# Altium schematic sheet Sheet1.SchDoc
size B
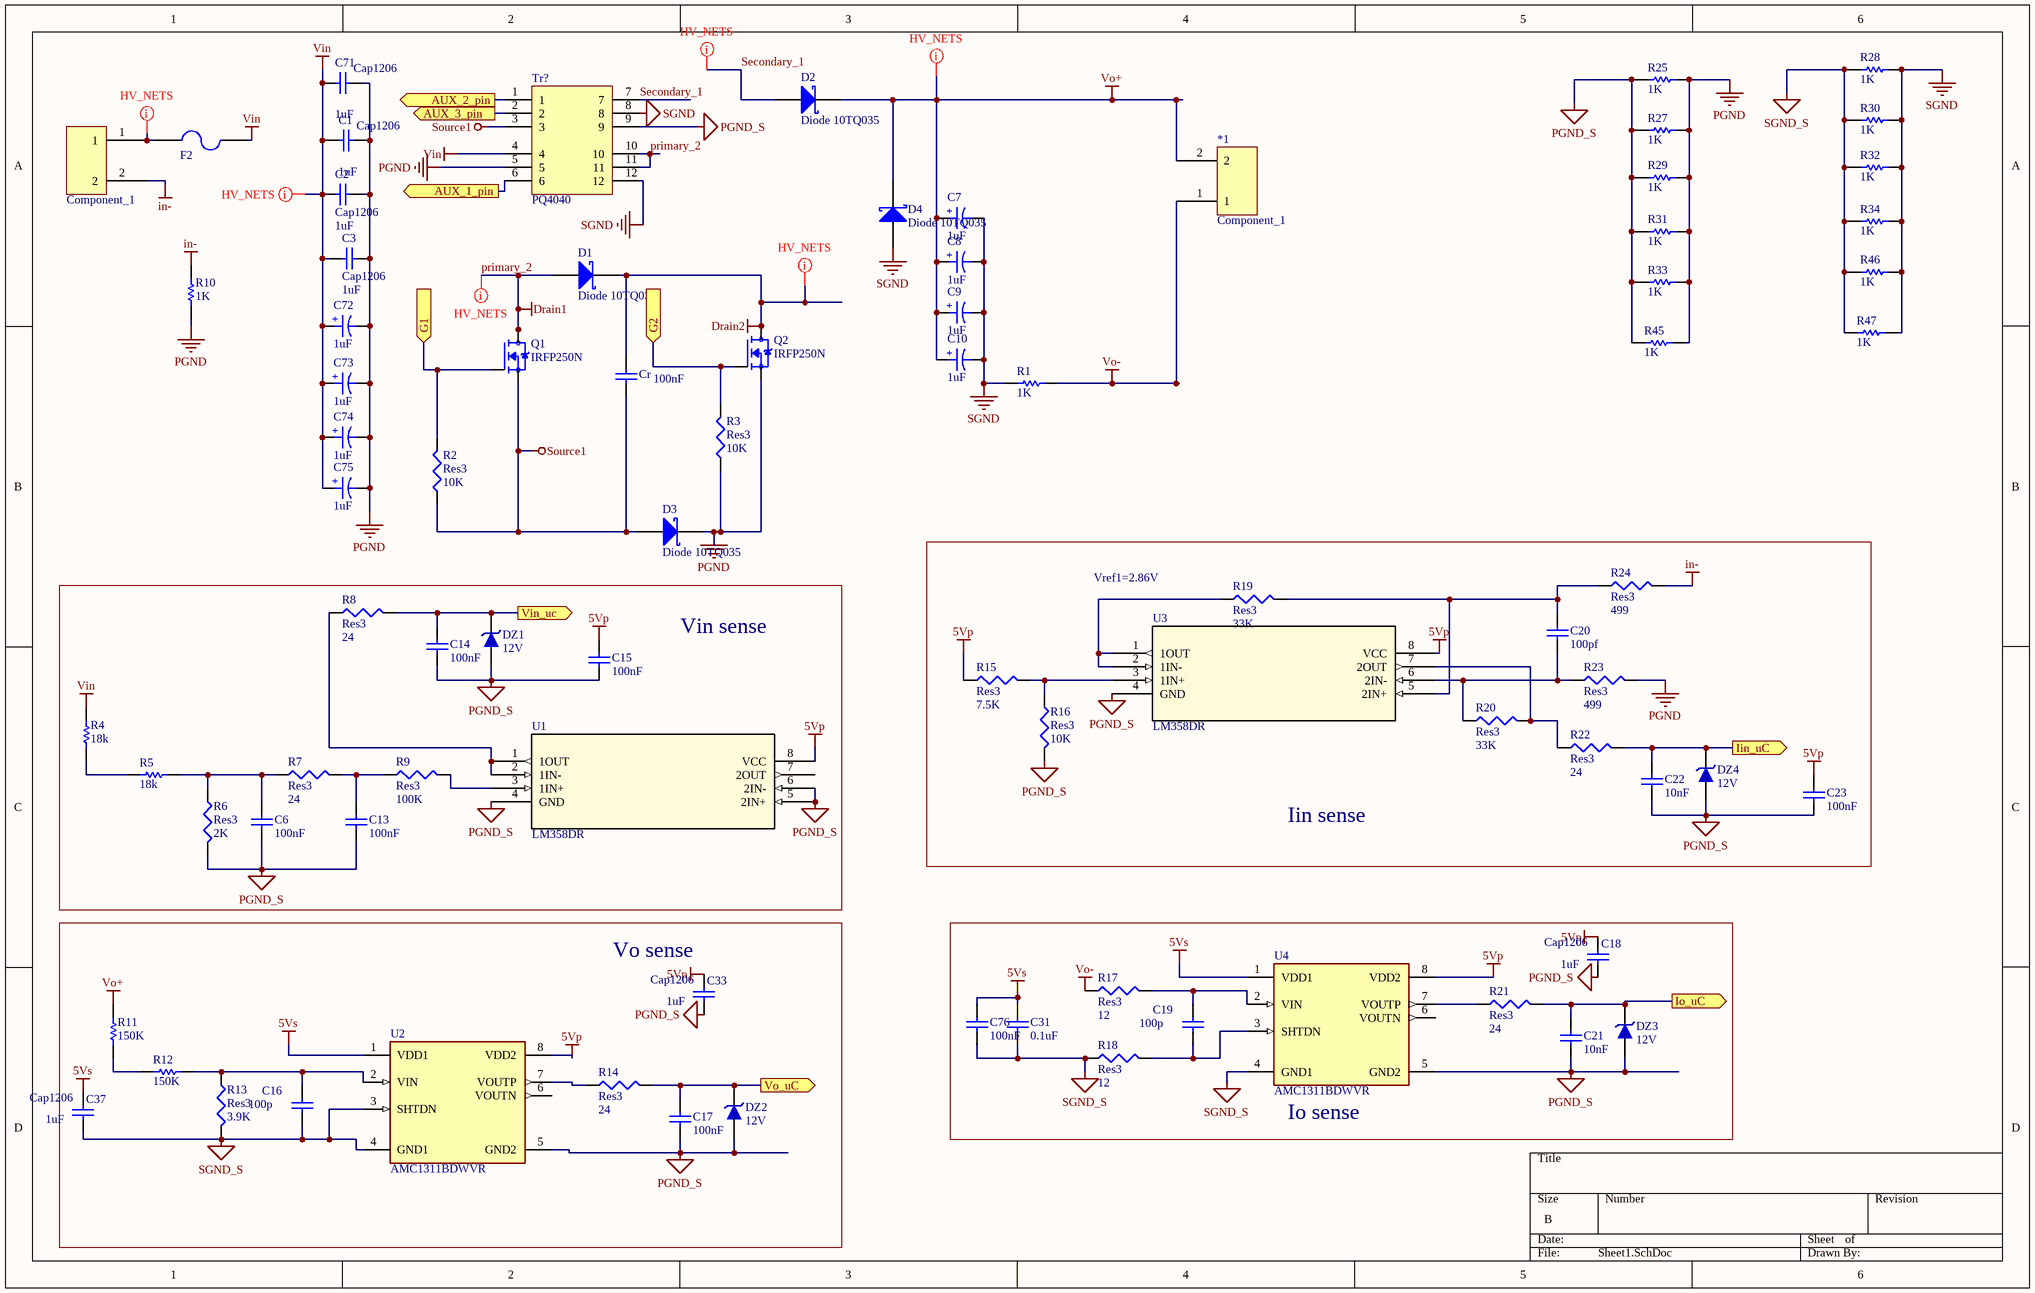
[diagram p0: Sheet1.SchDoc]

## Parts
*1  Component_1  [PCBComponent_1]
?  Component_1  [PCBComponent_1]
C1  Cap1206  value 1uF  [C1206]
C2  Cap1206  value 1uF  [C1206]
C3  Cap1206  value 1uF  [C1206]
C6  100nF  [CAP0603]
C7  1uF  [Cap electrolitic radial 12.5x25-5]
C8  1uF  [Cap electrolitic radial 12.5x25-5]
C9  1uF  [Cap electrolitic radial 16x26-7.5]
C10  1uF  [Cap electrolitic radial 16x26-7.5]
C13  100nF  [CAP0603]
C14  100nF  [CAP0603]
C15  100nF  [CAP0603]
C16  100p  [CAP0603]
C17  100nF  [CAP0603]
C18  Cap1206  value 1uF  [C1206]
C19  100p  [CAP0603]
C20  100pf  [CAP0603]
C21  10nF  [CAP0603]
C22  10nF  [CAP0603]
C23  100nF  [CAP0603]
C31  0.1uF  [CAPC4817X12N]
C33  Cap1206  value 1uF  [C1206]
C37  Cap1206  value 1uF  [C1206]
C71  Cap1206  value 1uF  [C1206]
C72  1uF  [Cap electrolitic radial 10x16-5]
C73  1uF  [Cap electrolitic radial 10x16-5]
C74  1uF  [Cap electrolitic radial 10x16-5]
C75  1uF  [Cap electrolitic radial 12.5x25-5]
C76  100nF  [CAP0603]
Cr  100nF  [CAP-100nF-275V]
D1  Diode 10TQ035  [TO-220AC]
D2  Diode 10TQ035  [TO-220AC]
D3  Diode 10TQ035  [TO-220AC]
D4  Diode 10TQ035  [TO-220AC]
DZ1  12V  [SOD80, LL-34]
DZ2  12V  [SOD80, LL-34]
DZ3  12V  [SOD80, LL-34]
DZ4  12V  [SOD80, LL-34]
F2  F=1.0 A  [Fuse 5x20 With holder pin]  (value not drawn)
Q1  IRFP250N  [TO545P1590X530X2460-3]
Q2  IRFP250N  [TO545P1590X530X2460-3]
R1  1K  [RES2512]
R2  Res3  value 10K  [J1-0603]
R3  Res3  value 10K  [J1-0603]
R4  18k  [RESC4817X04N]
R5  18k  [RESC4817X04N]
R6  Res3  value 2K  [J1-0603]
R7  Res3  value 24  [J1-0603]
R8  Res3  value 24  [J1-0603]
R9  Res3  value 100K  [J1-0603]
R10  1K  [RES2512]
R11  150K  [RESC4817X04N]
R12  150K  [RESC4817X04N]
R13  Res3  value 3.9K  [J1-0603]
R14  Res3  value 24  [J1-0603]
R15  Res3  value 7.5K  [J1-0603]
R16  Res3  value 10K  [J1-0603]
R17  Res3  value 12  [J1-0603]
R18  Res3  value 12  [J1-0603]
R19  Res3  value 33K  [J1-0603]
R20  Res3  value 33K  [J1-0603]
R21  Res3  value 24  [J1-0603]
R22  Res3  value 24  [J1-0603]
R23  Res3  value 499  [J1-0603]
R24  Res3  value 499  [J1-0603]
R25  1K  [RESC3413X04N]
R27  1K  [RESC3413X04N]
R28  1K  [RESC3413X04N]
R29  1K  [RESC3413X04N]
R30  1K  [RESC3413X04N]
R31  1K  [RESC3413X04N]
R32  1K  [RESC3413X04N]
R33  1K  [RESC3413X04N]
R34  1K  [RESC3413X04N]
R45  1K  [RESC3413X04N]
R46  1K  [RESC3413X04N]
R47  1K  [RESC3413X04N]
Tr?  PQ4040  [PQ4040]
U1  LM358DR  [D8]
U2  AMC1311BDWVR  [SOIC127P1150X280-8N]
U3  LM358DR  [D8]
U4  AMC1311BDWVR  [SOIC127P1150X280-8N]

## Blocks framed on the sheet
Iin sense: C20 C22 C23 DZ4 R15 R16 R19 R20 R22-R24 U3
Vin sense: C6 C13-C15 DZ1 R4-R9 U1
Vo sense: C16 C17 C33 C37 DZ2 R11-R14 U2
Io sense: C18 C19 C21 C31 C76 DZ3 R17 R18 R21 U4

## Ports
AUX_1_pin (out), AUX_2_pin (out), AUX_3_pin (out), G1 (in), G2 (in), Iin_uC (out), Io_uC (out), Vin_uc (out), Vo_uC (out)

## Nets
5Vp: C15.2 C18.1 C23.2 C33.1 R15.1 U1.8(VCC) U2.8(VDD2) U3.8(VCC) U4.8(VDD2)
5Vs: C31.1 C37.1 C76.2 U2.1(VDD1) U4.1(VDD1)
Drain2: Cr.2 D1.1(K) Q2.2(D)
in-: ?.2 R10.1 R24.2
PGND: C1.2 C2.2 C3.2 C71.2 C72.2 C73.2 C74.2 C75.2 D3.1(K) Q2.3(S) R3.1 R10.2 R23.2 R25.2 R27.2 R29.2 R31.2 R33.2 R45.2 Tr?.5
PGND_S: C6.1 C13.1 C14.1 C15.1 C17.1 C18.2 C21.1 C22.1 C23.1 C33.2 DZ1.1 DZ2.1 DZ3.1 DZ4.1 R6.2 R16.2 R25.1 R27.1 R29.1 R31.1 R33.1 R45.1 Tr?.9 U1.4(GND) U1.5(2IN+) U1.6(2IN-) U2.5(GND2) U3.4(GND) U4.5(GND2)
primary_2: D1.3(A) Q1.2(D) Tr?.10 Tr?.11  [also labelled Drain1]
SGND: C7.2 C8.2 C9.2 C10.2 D4.3(A) R1.1 R28.2 R30.2 R32.2 R34.2 R46.2 R47.2 Tr?.8 Tr?.12
SGND_S: C16.1 C31.2 C37.2 C76.1 R13.2 R18.1 R28.1 R30.1 R32.1 R34.1 R46.1 R47.1 U2.3(SHTDN) U2.4(GND1) U4.4(GND1)
Source1: Cr.1 D3.3(A) Q1.3(S) R2.1 Tr?.3
Vin: C1.1 C2.1 C3.1 C71.1 C72.1 C73.1 C74.1 C75.1 F2.2 R4.2 Tr?.4
Vo+: *1.2 C7.1 C8.1 C9.1 C10.1 D2.1(K) D4.1(K) R11.2
Vo-: *1.1 R1.2 R17.1
AUX_1_pin: Tr?.6 ; port AUX_1_pin
AUX_2_pin: Tr?.1 ; port AUX_2_pin
AUX_3_pin: Tr?.2 ; port AUX_3_pin
G1: Q1.1(G) R2.2 ; port G1
G2: Q2.1(G) R3.2 ; port G2
Iin_uC: C22.2 DZ4.2 R22.2 ; port Iin_uC
Io_uC: C21.2 DZ3.2 R21.2 ; port Io_uC
Secondary_1: D2.3(A) Tr?.7
Vin_uc: C14.2 DZ1.2 R8.2 ; port Vin_uc
Vo_uC: C17.2 DZ2.2 R14.2 ; port Vo_uC
Net?_1: ?.1 F2.1
NetC6_2: C6.2 R5.1 R6.1 R7.1
NetC13_2: C13.2 R7.2 R9.1
NetC16_2: C16.2 R12.1 R13.1 U2.2(VIN)
NetC19_1: C19.1 R18.2 U4.3(SHTDN)
NetC19_2: C19.2 R17.2 U4.2(VIN)
NetC20_1: C20.1 R20.1 R23.1 U3.6(2IN-)
NetC20_2: C20.2 R19.2 R24.1 U3.5(2IN+)
NetR4_1: R4.1 R5.2
NetR8_1: R8.1 U1.1(1OUT) U1.2(1IN-)
NetR9_2: R9.2 U1.3(1IN+)
NetR11_1: R11.1 R12.2
NetR14_1: R14.1 U2.7(VOUTP)
NetR15_2: R15.2 R16.1 U3.3(1IN+)
NetR19_1: R19.1 U3.1(1OUT) U3.2(1IN-)
NetR20_2: R20.2 R22.1 U3.7(2OUT)
NetR21_1: R21.1 U4.7(VOUTP)

Not connected (* = marked no-connect by the designer): U1 7(2OUT); U2 6(VOUTN); U4 6(VOUTN)

## Layout directives
net class HV_NETS: Drain2, Net?_1, primary_2, Secondary_1, Vin, Vo+

## Notes on the sheet
- Vref1=2.86V
- (in symbol Cap ELECTROLITIC TOTAL SIZE) +

## Library data of the parts
C1-C3 C18 C33 C37 C71 = Cap Semi: CAP, CERM, 1uF, 50V, +/-20%, X7R, 1206; Published: 8-Jun-2000; LatestRevisionDate: 29-May-2009; LatestRevisionNote: IPC-7351 Footprint Added.; PackageReference: C1206; Publisher: Altium Limited; PackageDescription: Chip Capacitor
C6 C13-C15 C17 C23 C76 = CAP SMD PACKAGE: TOTAL CAPACITOR SMD PACK; Designer: Abbas Basereh; Desc.: CAP SMD TOTAL PACKAGES; Data: 2017-3-10; VALUE: 100nF
C7-C10 C72-C75 = Cap ELECTROLITIC TOTAL SIZE: Cap electrolitic radial; Designer: Abbas Basereh; Data: 16-12-2016; Part. No: *; VALUE: 1uF
C16 C19-C22 = CAP SMD PACKAGE: TOTAL CAPACITOR SMD PACK; Designer: Abbas Basereh; Desc.: CAP SMD TOTAL PACKAGES; VALUE: 100nF; Data: 2017-3-10
C31 = CAP SMD 1206: CAP 1206; Designer: Abbas Basereh; Desc.: CAP SMD 1206; Data: 16-12-2016
Cr = CAP CERAMIC TOTAL SIZE: CAP Ceramic Total; Designer: Ali Hafizi
D1-D4 = Diode 10TQ035: Schottky Rectifier; Note: Terminal 2 is the TAB and is electrically connected to the cathode; Published: 8-Jun-2000; LatestRevisionDate: 17-Jul-2002; LatestRevisionNote: Re-released for DXP Platform.; DatasheetVersion: PD-2.057B; PackageVersion: Feb-1998; PackageReference: TO-220AC; Publisher: Altium Limited; PackageDescription: TO, Thru-Hole, Vertical, Heatsink Mounted; 3 In-Line Leads (1 Absent); Pitch 2.54 mm; ComponentLink1Description: Manufacturer Link; ComponentLink1URL: http://www.irf.com/; ComponentLink2Description: Datasheet; ComponentLink2URL: http://www.irf.com/product-info/datasheets/data/10tq.pdf
DZ1-DZ4 = ZENER GENERAL DIODE: DIODE ZENER GENERAL; Published: 2017-1-12; PackageVersion: 2017-1-12; PackageReference: DO 35; Publisher: Abbas Basereh; PackageDescription: DIODE GEN ZENER; ComponentLink1Description: Manufacturer Link; ComponentLink2Description: Datasheet; VALUE: 12V
F2 = Fuse 5x20 with holdeer pins: Fuses 5x20
Q1 Q2 = IRFP250N: To-247ac/Pkg 75m-Ohms Power Mosfet n-Channel 200-Volts 30-Amps 214-Watts; MF: Infineon Technologies; Value: *; SnapEDA_Link: https://www.snapeda.com/parts/IRFP250N/Infineon+Technologies/view-part/?ref=snap; Purchase-URL: https://pricing.snapeda.com/search/part/IRFP250N/?ref=eda; Availability: In Stock; Price: None; Package: TO-247 Infineon; Check_prices: https://www.snapeda.com/parts/IRFP250N/Infineon+Technologies/view-part/?ref=eda; MP: IRFP250N
R1 R10 = RES SMD PACKAGE: TOTAL SMD RESISTOR PACK; Designer: Abbas Basereh; Desc.: RES SMD PAKAGES; Data: 2017-3-10
R2 R3 R6-R9 R13-R24 = Res3: Resistor; Published: 8-Jun-2000; LatestRevisionDate: 29-May-2009; LatestRevisionNote: IPC-7351 Footprint Added.; PackageReference: J1-0603; Publisher: Altium Limited; PackageDescription: Chip Resistor
R4 R5 R11 R12 = RES 1206 0.25W: RES 1206; Designer: Abbas Basereh; Desc.: RES SMD 1206; Data: 16-12-2016
R25 R27-R34 R45-R47 = RES 0805 0.125W: RES 0805; Designer: Abbas Basereh; Desc.: RES SMD 0805; Data: 16-12-2016
U1 U3 = LM358DR: No Description Available; Mfr_Name: Texas Instruments; RefDes: RefDes; Type: Type
U2 U4 = AMC1311BDWVR: 2-V input, reinforced isolated amplifier with high CMTI for voltage sensing; MF: Texas Instruments; Check_prices: https://www.snapeda.com/parts/AMC1311BDWVR/Texas+Instruments/view-part/?ref=eda; Value: *; Purchase-URL: https://pricing.snapeda.com/search/part/AMC1311BDWVR/?ref=eda; Price: None; MP: AMC1311BDWVR; SnapEDA_Link: https://www.snapeda.com/parts/AMC1311BDWVR/Texas+Instruments/view-part/?ref=snap; Availability: In Stock; Package: SOIC-8 Texas Instruments